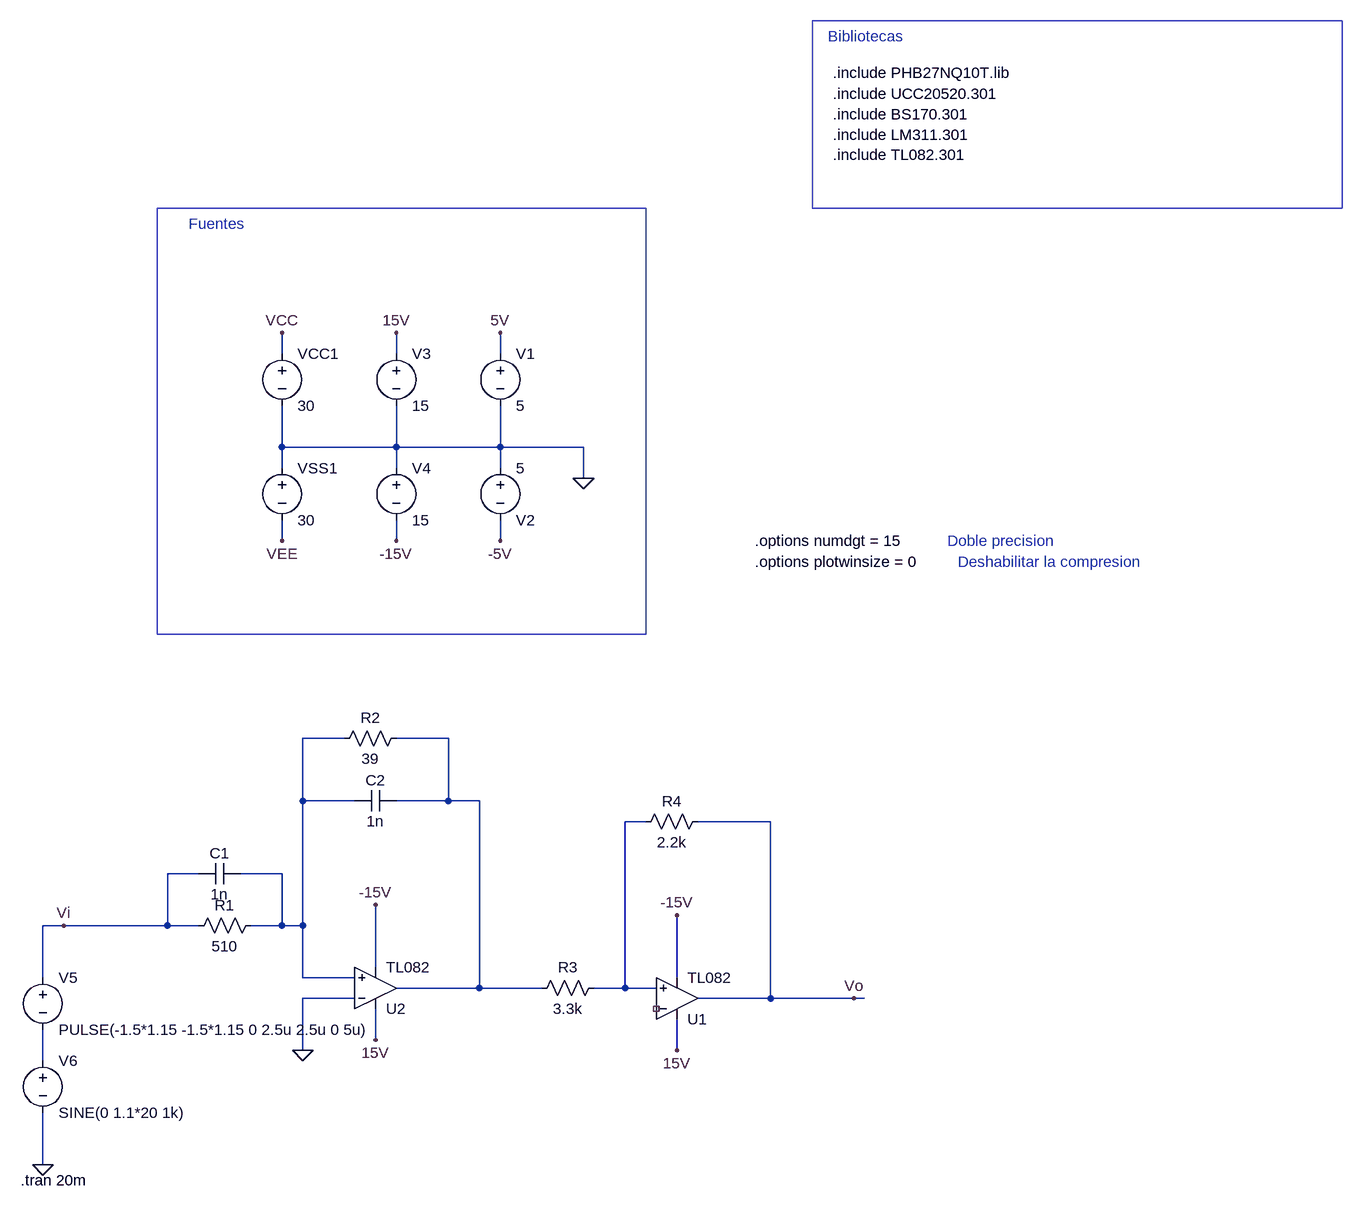
[diagram p0: schematic Compensador.asc]
Compensador.asc, the LTspice schematic file:
Version 4
SHEET 1 1412 1240
WIRE -224 -48 -224 -80
WIRE -48 -48 -48 -80
WIRE 112 -48 112 -80
WIRE -224 96 -224 32
WIRE -48 96 -48 32
WIRE -48 96 -224 96
WIRE 112 96 112 32
WIRE 112 96 -48 96
WIRE 240 96 112 96
WIRE -224 128 -224 96
WIRE -48 128 -48 96
WIRE 112 128 112 96
WIRE 240 144 240 96
WIRE -224 240 -224 208
WIRE -48 240 -48 208
WIRE 112 240 112 208
WIRE -128 544 -192 544
WIRE 32 544 -48 544
WIRE -192 640 -192 544
WIRE -112 640 -192 640
WIRE 32 640 32 544
WIRE 32 640 -48 640
WIRE 80 640 32 640
WIRE 336 672 304 672
WIRE 528 672 416 672
WIRE -352 752 -400 752
WIRE -224 752 -288 752
WIRE -560 832 -592 832
WIRE -400 832 -400 752
WIRE -400 832 -560 832
WIRE -352 832 -400 832
WIRE -224 832 -224 752
WIRE -224 832 -272 832
WIRE -192 832 -192 640
WIRE -192 832 -224 832
WIRE -80 896 -80 800
WIRE -592 912 -592 832
WIRE -192 912 -192 832
WIRE -112 912 -192 912
WIRE 384 912 384 816
WIRE 80 928 80 640
WIRE 80 928 -48 928
WIRE 176 928 80 928
WIRE 304 928 304 672
WIRE 304 928 256 928
WIRE 352 928 304 928
WIRE -112 944 -192 944
WIRE 528 944 528 672
WIRE 528 944 416 944
WIRE 656 944 528 944
WIRE 672 944 656 944
WIRE -80 1008 -80 960
WIRE -192 1024 -192 944
WIRE 384 1024 384 976
WIRE -592 1040 -592 992
WIRE -592 1200 -592 1120
FLAG -224 -80 VCC
FLAG -224 240 VEE
FLAG 112 -80 5V
FLAG 112 240 -5V
FLAG 240 144 0
FLAG -48 240 -15V
FLAG -48 -80 15V
FLAG -80 1008 15V
FLAG -80 800 -15V
FLAG -192 1024 0
FLAG 384 1024 15V
FLAG 384 816 -15V
FLAG 656 944 Vo
FLAG -560 832 Vi
FLAG -592 1200 0
SYMBOL voltage -224 -64 R0
WINDOW 123 0 0 Left 2
WINDOW 39 0 0 Left 2
SYMATTR InstName VCC1
SYMATTR Value 30
SYMBOL voltage -224 112 R0
WINDOW 123 0 0 Left 2
WINDOW 39 0 0 Left 2
SYMATTR InstName VSS1
SYMATTR Value 30
SYMBOL voltage 112 -64 R0
SYMATTR InstName V1
SYMATTR Value 5
SYMBOL voltage 112 112 R0
WINDOW 0 24 96 Left 2
WINDOW 3 24 16 Left 2
WINDOW 123 0 0 Left 0
WINDOW 39 0 0 Left 0
SYMATTR InstName V2
SYMATTR Value 5
SYMBOL voltage -48 -64 R0
WINDOW 123 0 0 Left 0
WINDOW 39 0 0 Left 0
SYMATTR InstName V3
SYMATTR Value 15
SYMBOL voltage -48 112 R0
WINDOW 123 0 0 Left 0
WINDOW 39 0 0 Left 0
SYMATTR InstName V4
SYMATTR Value 15
SYMBOL Opamps\\opamp2 -80 992 M180
SYMATTR InstName U2
SYMATTR Value TL082
SYMBOL cap -112 624 M90
WINDOW 0 0 32 VBottom 2
WINDOW 3 32 32 VTop 2
SYMATTR InstName C2
SYMATTR Value 1n
SYMBOL res -32 528 R90
WINDOW 0 0 56 VBottom 2
WINDOW 3 32 56 VTop 2
SYMATTR InstName R2
SYMATTR Value 39
SYMBOL res -256 816 R90
WINDOW 0 0 56 VBottom 2
WINDOW 3 32 56 VTop 2
SYMATTR InstName R1
SYMATTR Value 510
SYMBOL cap -288 736 R90
WINDOW 0 0 32 VBottom 2
WINDOW 3 32 32 VTop 2
SYMATTR InstName C1
SYMATTR Value 1n
SYMBOL Opamps\\opamp2 384 1008 M180
SYMATTR InstName U1
SYMATTR Value TL082
SYMBOL res 272 912 R90
WINDOW 0 0 56 VBottom 2
WINDOW 3 32 56 VTop 2
SYMATTR InstName R3
SYMATTR Value 3.3k
SYMBOL res 432 656 R90
WINDOW 0 0 56 VBottom 2
WINDOW 3 32 56 VTop 2
SYMATTR InstName R4
SYMATTR Value 2.2k
SYMBOL voltage -592 896 R0
WINDOW 123 0 0 Left 0
WINDOW 39 0 0 Left 0
SYMATTR InstName V5
SYMATTR Value PULSE(-1.5*1.15 -1.5*1.15 0 2.5u 2.5u 0 5u)
SYMBOL voltage -592 1024 R0
WINDOW 123 0 0 Left 0
WINDOW 39 0 0 Left 0
SYMATTR InstName V6
SYMATTR Value SINE(0 1.1*20 1k)
TEXT -368 -248 Left 2 ;Fuentes
TEXT 624 -448 Left 2 !.include UCC20520.301
TEXT 616 -536 Left 2 ;Bibliotecas
TEXT 624 -480 Left 2 !.include PHB27NQ10T.lib
TEXT 624 -416 Left 2 !.include BS170.301\n.include LM311.301\n.include TL082.301
TEXT 504 240 Left 2 !.options numdgt = 15
TEXT 800 240 Left 2 ;Doble precision
TEXT 504 272 Left 2 !.options plotwinsize = 0
TEXT 816 272 Left 2 ;Deshabilitar la compresion
TEXT -626 1224 Left 2 !.tran 20m
RECTANGLE Normal -416 -272 336 384
RECTANGLE Normal 1408 -560 592 -272

The netlist it stands for:
* Compensador.asc
VCC1 VCC 0 30
VSS1 0 VEE 30
V1 5V 0 5
V2 0 -5V 5
V3 15V 0 15
V4 0 -15V 15
XU2 N001 0 15V -15V N002 TL082  ; pins In+ In- V+ V- OUT
C2 N001 N002 1n
R2 N002 N001 39
R1 N001 Vi 510
C1 N001 Vi 1n
XU1 N003 NC_01 15V -15V Vo TL082  ; pins In+ In- V+ V- OUT
R3 N003 N002 3.3k
R4 Vo N003 2.2k
V5 Vi N004 PULSE(-1.5*1.15 -1.5*1.15 0 2.5u 2.5u 0 5u)
V6 N004 0 SINE(0 1.1*20 1k)
* Fuentes
.include UCC20520.301
* Bibliotecas
.include PHB27NQ10T.lib
.include BS170.301
.include LM311.301
.include TL082.301
.options numdgt = 15
* Doble precision
.options plotwinsize = 0
* Deshabilitar la compresion
.tran 20m
.backanno
.end